# Altium schematic sheet SCH_Modules.SchDoc: Modules
size A4; DrawnBy: Melvin Tong; Revision: v1.1; SheetNumber: 3; SheetTotal: 3
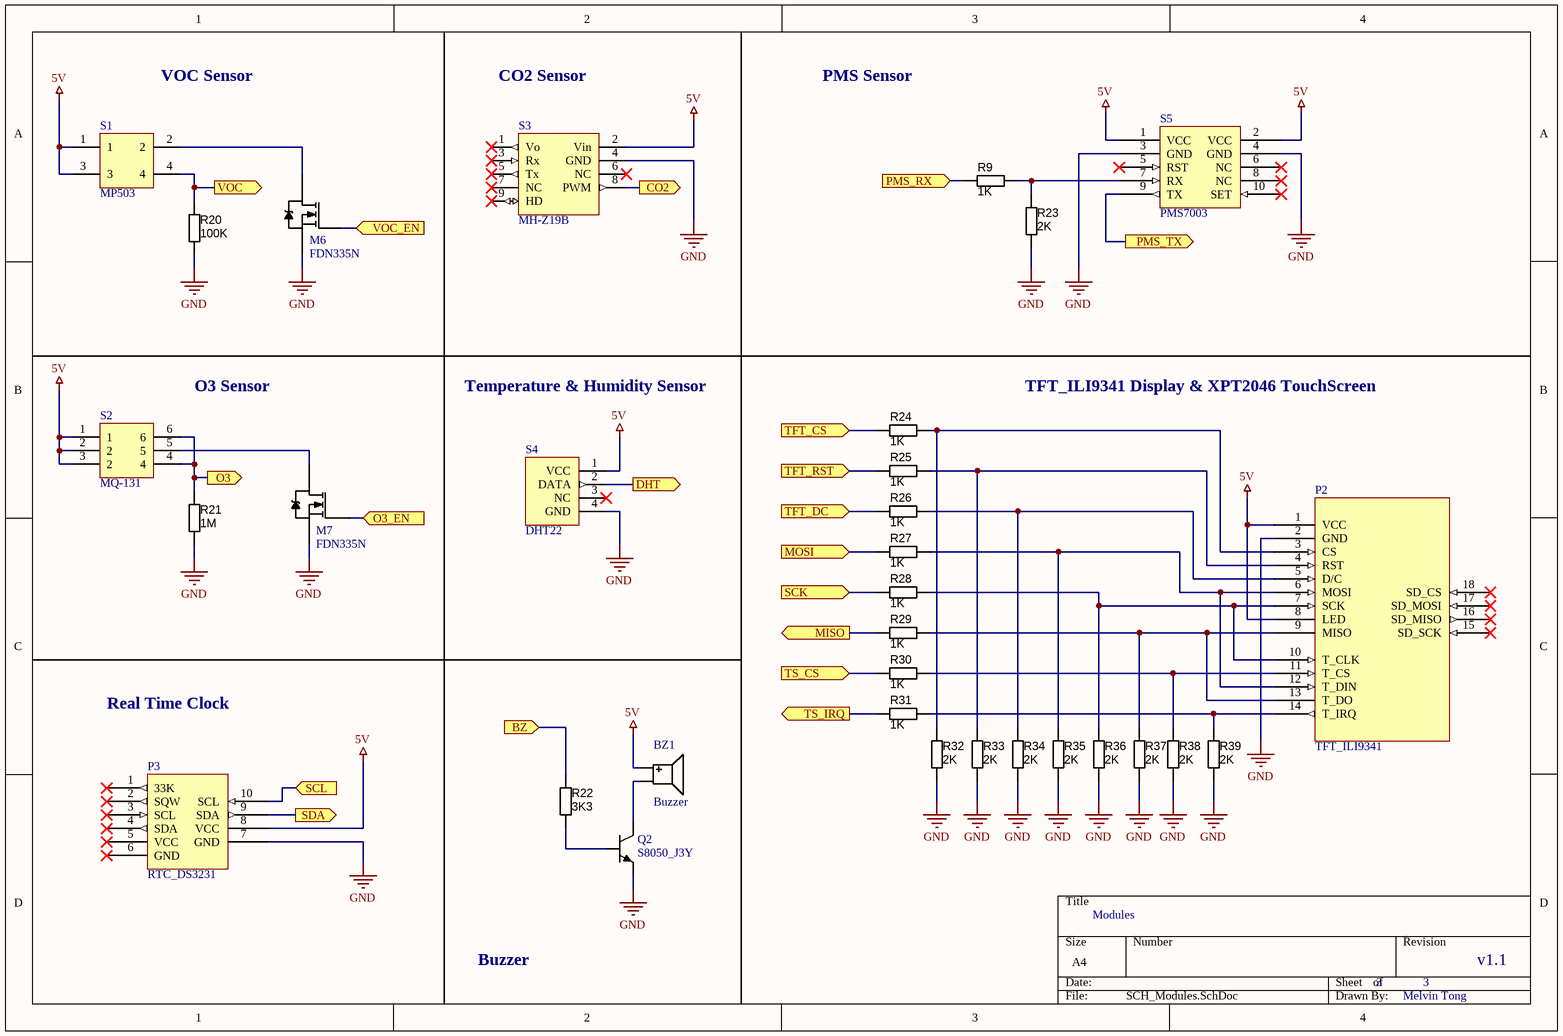
[diagram p0: SCH_Modules.SchDoc]

## Parts
BZ1  Buzzer  [BZ_12085]
M6  FDN335N  [SOT23_213]
M7  FDN335N  [SOT23_213]
P2  TFT_ILI9341  [TFT_ILI9341]
P3  RTC_DS3231  [DS3231 RTC]
Q2  S8050_J3Y  [SOT23_213]
R9  1K  [RESC3216X70N]
R20  100K  [RESC3216X70N]
R21  1M  [RESC3216X70N]
R22  3K3  [RESC3216X70N]
R23  2K  [RESC3216X70N]
R24  1K  [RESC3216X70N]
R25  1K  [RESC3216X70N]
R26  1K  [RESC3216X70N]
R27  1K  [RESC3216X70N]
R28  1K  [RESC3216X70N]
R29  1K  [RESC3216X70N]
R30  1K  [RESC3216X70N]
R31  1K  [RESC3216X70N]
R32  2K  [RESC3216X70N]
R33  2K  [RESC3216X70N]
R34  2K  [RESC3216X70N]
R35  2K  [RESC3216X70N]
R36  2K  [RESC3216X70N]
R37  2K  [RESC3216X70N]
R38  2K  [RESC3216X70N]
R39  2K  [RESC3216X70N]
S1  MP503  [MP503 VOC Sensor]
S2  MQ-131  [MQ-131 Ozone Sensor]
S3  MH-Z19B  [MH-Z19B CO2 Sensor]
S4  DHT22  [DHT22]
S5  PMS7003  [PMS7003]

## Ports
BZ (in), CO2 (out), DHT (out), MISO (out), MOSI (in), O3 (out), O3_EN (in), PMS_RX (in), PMS_TX (out), SCK (in), SCL (in), SDA (out), TFT_CS (in), TFT_DC (in), TFT_RST (in), TS_CS (in), TS_IRQ (out), VOC (out), VOC_EN (in)

## Nets
5V: BZ1.1(Positive) P2.1(VCC) P2.8(LED) P3.8(VCC) S1.1 S1.3 S2.1 S2.2 S2.3(2) S3.2(Vin) S4.1(VCC) S5.1(VCC) S5.2(VCC)
GND: M6.2(S) M7.2(S) P2.2(GND) P3.7(GND) Q2.2(E) R20.2 R21.2 R23.2 R32.2 R33.2 R34.2 R35.2 R36.2 R37.2 R38.2 R39.2 S3.4(GND) S4.4(GND) S5.3(GND) S5.4(GND)
BZ: R22.1 ; port BZ
CO2: S3.8(PWM) ; port CO2
DHT: S4.2(DATA) ; port DHT
MISO: R29.1 ; port MISO
MOSI: R27.1 ; port MOSI
O3: R21.1 S2.4 S2.6 ; port O3
O3_EN: M7.1(G) ; port O3_EN
PMS_RX: R9.1 ; port PMS_RX
PMS_TX: S5.9(TX) ; port PMS_TX
SCK: R28.1 ; port SCK
SCL: P3.10(SCL) ; port SCL
SDA: P3.9(SDA) ; port SDA
TFT_CS: R24.1 ; port TFT_CS
TFT_DC: R26.1 ; port TFT_DC
TFT_RST: R25.1 ; port TFT_RST
TS_CS: R30.1 ; port TS_CS
TS_IRQ: R31.1 ; port TS_IRQ
VOC: R20.1 S1.4 ; port VOC
VOC_EN: M6.1(G) ; port VOC_EN
NetBZ1_2: BZ1.2(Negative) Q2.3(C)
NetM6_3: M6.3(D) S1.2
NetM7_3: M7.3(D) S2.5
NetP2_3: P2.3(CS) R24.2 R32.1
NetP2_4: P2.4(RST) R25.2 R33.1
NetP2_5: P2.5(D/C) R26.2 R34.1
NetP2_6: P2.6(MOSI) P2.12(T_DIN) R27.2 R35.1
NetP2_7: P2.7(SCK) P2.10(T_CLK) R28.2 R36.1
NetP2_9: P2.9(MISO) P2.13(T_DO) R29.2 R37.1
NetP2_11: P2.11(T_CS) R30.2 R38.1
NetP2_14: P2.14(T_IRQ) R31.2 R39.1
NetQ2_1: Q2.1(B) R22.2
NetR9_2: R9.2 R23.1 S5.7(RX)

Not connected (* = marked no-connect by the designer): P2 15(SD_SCK)* 16(SD_MISO)* 17(SD_MOSI)* 18(SD_CS)*; P3 1(33K)* 2(SQW)* 3(SCL)* 4(SDA)* 5(VCC)* 6(GND)*; S3 1(Vo)* 3(Rx)* 5(Tx)* 6(NC)* 7(NC)* 9(HD)*; S4 3(NC)*; S5 5(RST)* 6(NC)* 8(NC)* 10(SET)*

## Notes on the sheet
- VOC Sensor
- CO2 Sensor
- PMS Sensor
- O3 Sensor
- Temperature & Humidity Sensor
- TFT_ILI9341 Display & XPT2046 TouchScreen
- Real Time Clock
- Buzzer

## Library data of the parts
BZ1 = Buzzer: Buzzer passive 5 VAC
M6 M7 = NMOS
P3 = RTC_DS3231: Real Time Clock
Q2 = NPN
R9 R24-R31 = RES_1K: Resistor SMD, 1206; Value: N/A
R20 = RES_100K: Resistor SMD, 1206; Value: N/A
R21 = RES_1M: Resistor SMD, 1206; Value: N/A
R22 = RES_3K3: Resistor SMD, 1206; Value: N/A
R23 R32-R39 = RES_2K: Resistor SMD, 1206; Value: N/A
S1 = MP503: VOC Sensor
S2 = MQ-131: Ozone Sensor
S3 = MH-Z19B: CO2 Sensor
S5 = PMS7003: Particle air sensor. 1um, 2.5um, 10um